# EAGLE design MainBoardV4 (EAGLE 9.5.2)
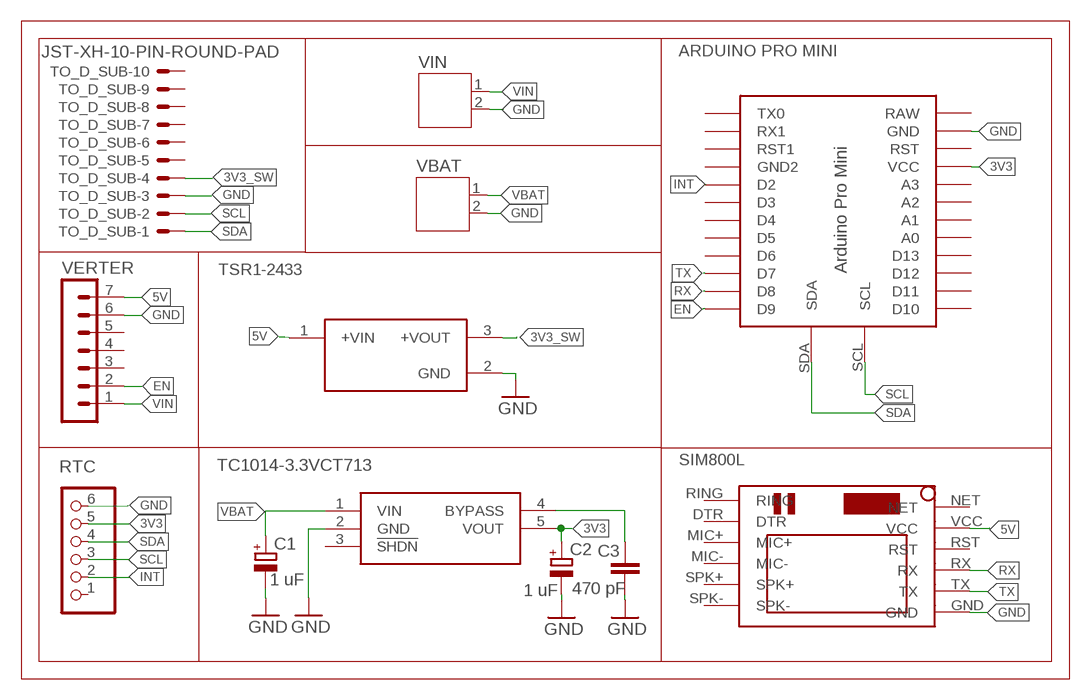
[diagram p0: schematic, sheet 1]

## Parts
C1  1 uF  CPOL-EUB/3528-21R  [B/3528-21R]
C2  1 uF  CPOL-EUB/3528-21R  [B/3528-21R]
C3  470 pF  C-EUC1206  [C1206]
RTC  PINHD-1X6  [1X06]
TO_D_SUB  JST-XH-10-PIN-ROUND-PAD  [JST-XH-10-PACKAGE-ROUND-PAD]
TSR1-2433  TSR_1-2433  [CONV_TSR_1-2433]
U1  TC1014-3.3VCT713  [SOT95P270X130-5N]
U$1  SIM800LMODULE  [SIM800LMODULE]
U$2  ABK-PRO-MINI  [ABK-PRO-MINI]
VBAT  JST-PH2  [JST-PH2]
VERTER  MA07-1  [MA07-1]
VIN  JST-PH2  [JST-PH2]

## Nets
3V3: C2.+ RTC.5 U1.5(VOUT) U$2.VCC
3V3_SW: TO_D_SUB.4 TSR1-2433.3(+VOUT)
5V: TSR1-2433.1(+VIN) U$1.VCC VERTER.7
EN: U$2.D9 VERTER.2
GND: C1.- C2.- C3.1 RTC.6 TO_D_SUB.3 TSR1-2433.2(GND) U1.2(GND) U$1.GND U$2.GND VBAT.2 VERTER.6 VIN.2
INT: RTC.2 U$2.D2
N$4: C3.2 U1.4(BYPASS)
RX: U$1.RX U$2.D8
SCL: RTC.3 TO_D_SUB.2 U$2.SCL
SDA: RTC.4 TO_D_SUB.1 U$2.SDA
TX: U$1.TX U$2.D7
VBAT: C1.+ U1.1(VIN) VBAT.1
VIN: VERTER.1 VIN.1
Unconnected: RTC.1 TO_D_SUB.5 TO_D_SUB.6 TO_D_SUB.7 TO_D_SUB.8 TO_D_SUB.9 TO_D_SUB.10 U1.3(!SHDN) U$1.DTR U$1.MIC+ U$1.MIC- U$1.NET U$1.RING U$1.RST U$1.SPK+ U$1.SPK- U$2.A0 U$2.A1 U$2.A2 U$2.A3 U$2.D3 U$2.D4 U$2.D5 U$2.D6 U$2.D10 U$2.D11 U$2.D12 U$2.D13 U$2.GND1(GND2) U$2.RAW U$2.RST U$2.RST1 U$2.RX1 U$2.TX0 VERTER.3 VERTER.4 VERTER.5

## Notes on the sheet
- ARDUINO PRO MINI
- SIM800L

## Library data of the parts
C1 C2 = rcl:CPOL-EU: POLARIZED CAPACITOR, European symbol; SPICEPREFIX: C
C3 = rcl:C-EU: CAPACITOR, European symbol; SPICEPREFIX: C
RTC = pinhead:PINHD-1X6: PIN HEADER
TO_D_SUB = Rembrandt Electronics - JST XH Connectors v1-0:JST-XH-10-PIN: JST XH Connector 2 Pin Wire to board connector. Pitch: 2,54 mm, (0.100") Number of pins: 10 Created by Rembrandt Electronics www.rembrandtelectronics.com
TSR1-2433 = TSR_1-2433:TSR_1-2433: Linear Regulator Replacement DC DC Converter 1 Output 12V 1A 15V - 36V Input; AVAILABILITY: Unavailable; DESCRIPTION: Linear Regulator Replacement DC DC Converter 1 Output 3.3V 1A 4.75V - 36V Input; MF: Traco Power; MP: TSR 1-2433; PACKAGE: SIP-3 Tracopower; PRICE: None
U1 = TC1014-3.3VCT713:TC1014-3.3VCT713: Microchip TC1014-3.3VCT713, LDO Voltage Regulator, 0.05A, 3.3 V +/-2.5%, 2.7 6 Vin, 5-Pin SOT-23 Source: Datasheet <http://docs-emea.rs-online.com/webdocs/1385/0900766b81385f8a.pdf>; DESCRIPTION: Microchip TC1014-3.3VCT713, LDO Voltage Regulator, 0.05A, 3.3 V +/-2.5%, 2.7 6 Vin, 5-Pin SOT-23; HEIGHT: 1.3mm; MANUFACTURER_NAME: Microchip; MANUFACTURER_PART_NUMBER: TC1014-3.3VCT713; MOUSER_PART_NUMBER: 579-TC1014-3.3VCT713; MOUSER_PRICE-STOCK: https://www.mouser.com/Search/Refine.aspx?Keyword=579-TC1014-3.3VCT713; RS_PART_NUMBER: 2508430654; RS_PRICE-STOCK: http://uk.rs-online.com/web/p/products/2508430654
U$1 = SIM800LMODULE:SIM800LMODULE: SIM800L Module
U$2 = Arduino-clone:ABK-PRO-MINI: ABK Pro-Mini Arduino Clone
VBAT VIN = jst-ph:JST-PH2
VERTER = con-lstb:MA07-1: PIN HEADER; OC_FARNELL: unknown; OC_NEWARK: unknown

## Board
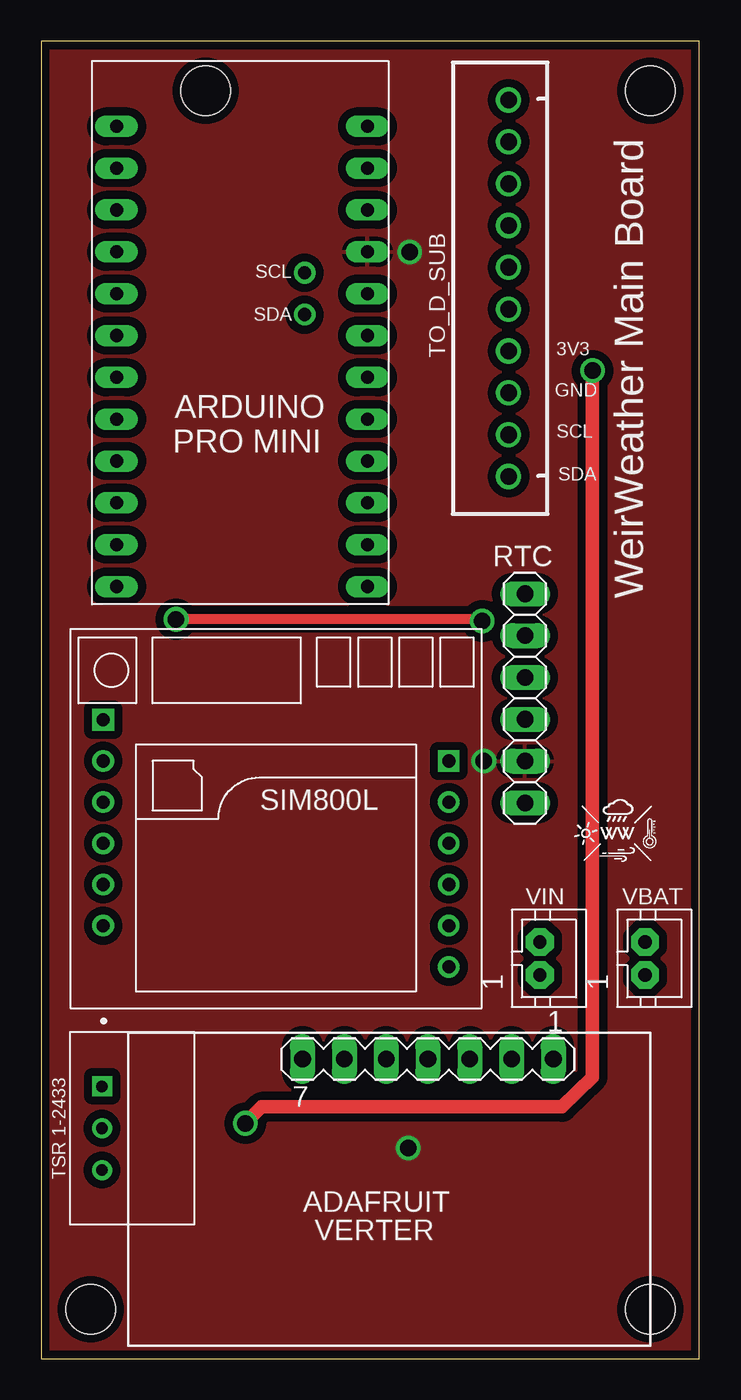
[diagram p1: board, top side]
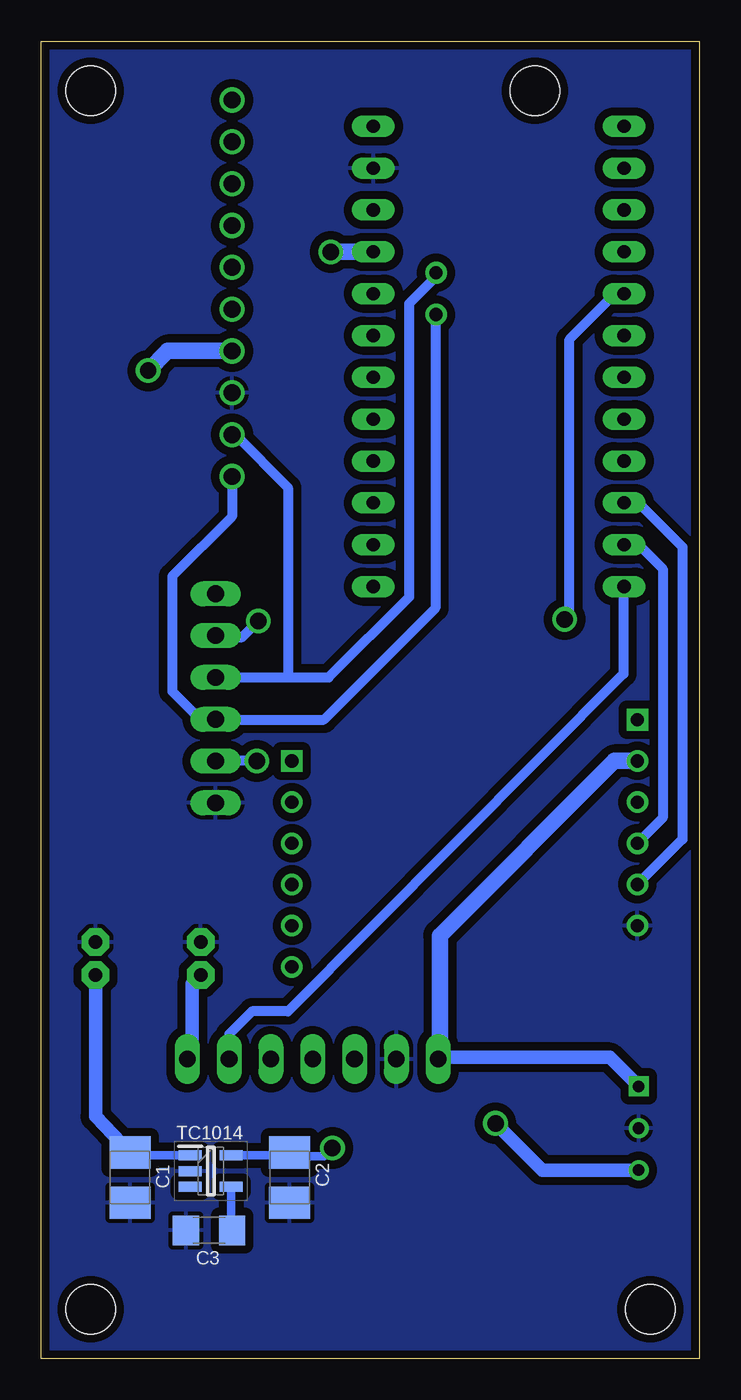
[diagram p2: board, bottom side, seen from below]

Size 40 x 80 mm. Coordinates in mm from the lower left corner, seen from the top.
Outline: 0,0 40,0 40,80 0,80 0,0
Copper layers (1*16): Top 0.035mm / dielectric 1.5mm / Bottom 0.035mm
Design rules "default *": minimum track width 6mil, minimum drill 0.35mm, track to track 0.5mm, track to pad 0.5mm, pad to pad 0.5mm, via to via 0.5mm, smd to smd 0.5mm, copper to edge 0.5mm, drill to drill 20mil, minimum pad ring 10mil, minimum via ring 8mil, stop-mask expansion 4mil, vias tented up to drill 0mil, thermal gap 10mil
Holes 3 mm at 3,3 37,3 10,77 37,77

### Footprints (pad centres in the part's own frame; a part is rotated, then mirrored left to right if it is on the bottom)
B/3528-21R = smd 1.95 x 2.5: + 1.525,0; - -1.525,0
C1206 = smd 1.6 x 1.8: 1 -1.4,0; 2 1.4,0
1X06 = drill 1.016 long: 1 -6.35,0; 2 -3.81,0; 3 -1.27,0; 4 1.27,0; 5 3.81,0; 6 6.35,0
JST-XH-10-PACKAGE-ROUND-PAD = drill 1.016: 1 -11.43,0; 2 -8.89,0; 3 -6.35,0; 4 -3.81,0; 5 -1.27,0; 6 1.27,0; 7 3.81,0; 8 6.35,0; 9 8.89,0; 10 11.43,0
CONV_TSR_1-2433 = drill 0.71 pad 1.11 square: 1 -2.54,0 | drill 0.71 pad 1.11: 2 0,0; 3 2.54,0
SOT95P270X130-5N = smd 1.4 x 0.6: 1 -1.25,0.95; 2 -1.25,0; 3 -1.25,-0.95; 4 1.25,-0.95; 5 1.25,0.95
SIM800LMODULE = drill 0.8: DTR 10.5,1; GND -10.5,-6.5; MIC+ 10.5,-1.5; MIC- 10.5,-4; RST -10.5,1; RX -10.5,-1.5; SPK+ 10.5,-6.5; SPK- 10.5,-9; TX -10.5,-4; VCC -10.5,3.5 | drill 0.8 square: NET -10.5,6; RING 10.5,3.5
ABK-PRO-MINI = drill 0.8 long: A0 10.16,-3.81; A1 10.16,-6.35; A2 10.16,-8.89; A3 10.16,-11.43; D2 -5.08,-3.81; D3 -5.08,-6.35; D4 -5.08,-8.89; D5 -5.08,-11.43; D6 -5.08,-13.97; D7 -5.08,-16.51; D8 -5.08,-19.05; D9 -5.08,-21.59; D10 10.16,-21.59; D11 10.16,-19.05; D12 10.16,-16.51; D13 10.16,-13.97; GND 10.16,3.81; GND1 -5.08,-1.27; RAW 10.16,6.35; RST 10.16,1.27; RST1 -5.08,1.27; RX1 -5.08,3.81; TX0 -5.08,6.35; VCC 10.16,-1.27 | drill 0.8: SCL 6.35,-2.54; SDA 6.35,-5.08
JST-PH2 = drill 0.813 pad 1.676 octagon: 1 1,0; 2 -1,0
MA07-1 = drill 1.016 long: 1 -7.62,0; 2 -5.08,0; 3 -2.54,0; 4 0,0; 5 2.54,0; 6 5.08,0; 7 7.62,0

### Placement (x,y rotation side)
C1  34.6,11 90 bottom
C2  24.9,11 90 bottom
C3  29.8,7.8 0 bottom
RTC  29.4,40.1 270 top
TO_D_SUB  28.4,65 90 top
TSR1-2433  3.7,14 270 top
U1  29.7,11.4 0 bottom
U$1  14.27,32.8 0 top
U$2  9.66,68.48 0 top
VBAT  36.7,24.3 270 top
VERTER  23.5,18.2 180 top
VIN  30.3,24.3 270 top

### Tracks (layer width: path | path; a pad name or v marks a point on that pad's centre or on a via)
3V3  (via drill 1)
  Bottom 0.508: v22.3,12.8 22.8,12.3 24.68,12.3 | C2.+ 25.07,12.35 U1.5
  Bottom 0.61: v26.9,36.3 RTC.5
  Bottom 0.813: C2.+ 24.68,12.3
  Bottom 1.016: v22.4,67.2 U$2.VCC
  pour Top: 0,80 40,80 40,0 0,0
3V3_SW  (via drill 1)
  Top 0.813: v12.4,14.3 13.4,15.3 31.64,15.3 33.5,17.1 v33.5,60
  Bottom 0.813: TSR1-2433.3 9.56,11.46 v12.4,14.3
  Bottom 1.016: TO_D_SUB.4 32.31,61.19 v33.5,60
5V
  Bottom 0.813: TSR1-2433.1 5.46,18.3 15.78,18.3
  Bottom 1.016: U$1.VCC 5.17,36.3 15.78,25.69 15.78,18.3 VERTER.7
EN
  Bottom 0.61: VERTER.2 28.58,19.72 27.2,21.1 25,21.1 4.62,41.59 4.62,46.85 U$2.D9
GND
  pour Bottom: 0,80 0,0 40,0 40,80
INT  (via drill 1)
  Top 0.61: v26.8,44.8 26.7,44.9 v8.2,44.9
  Bottom 0.61: RTC.2 29.3,43.81 27.79,43.81 v26.8,44.8 | v8.2,44.9 8.13,44.9 7.9,45.13 7.9,61.9 5.11,64.69 4.6,64.69 U$2.D2
N$4
  Bottom 0.508: U1.4 28.45,7.85 C3.2
RX
  Bottom 0.61: U$1.RX 2.23,32.84 2.23,47.96 3.72,49.45 3.74,49.43 U$2.D8
SCL
  Bottom 0.61: RTC.3 26.4,41.37 25,41.37 | 25,41.37 22.53,41.37 17.65,46.25 17.65,64.06 16.05,65.66 16.05,65.9 U$2.SCL | TO_D_SUB.2 28.2,56.1 25,52.9 25,41.37
SDA
  Bottom 0.61: TO_D_SUB.1 28.4,51.13 32.03,47.5 32.03,40.52 30.34,38.83 RTC.4 29.37,38.8 22.83,38.8 16.05,45.58 16.05,63.36 U$2.SDA
TX
  Bottom 0.61: 3.72,51.99 1.03,49.3 1.03,31.54 U$1.TX | U$2.D7 4.1,51.97
  Bottom 0.813: 4.1,51.97 3.74,51.97 3.72,51.99
VBAT
  Bottom 0.508: U1.1 34.33,12.35 C1.+
  Bottom 0.813: C1.+ 36.7,14.72 VBAT.1
VIN
  Bottom 0.61: 31.05,18.13 VERTER.1
  Bottom 0.813: VIN.1 30.82,22.78 30.82,18.5 VERTER.1

### Text on the board
tNames: WeirWeather Main Board | SCL | SDA | 3V3 | GND | ARDUINO | SCL | PRO MINI | SDA | VIN | VBAT | TSR 1-2433 | ADAFRUIT
bNames: TC1014 | C2 | C1 | C3